# EAGLE design programmer (EAGLE 6.5.0)
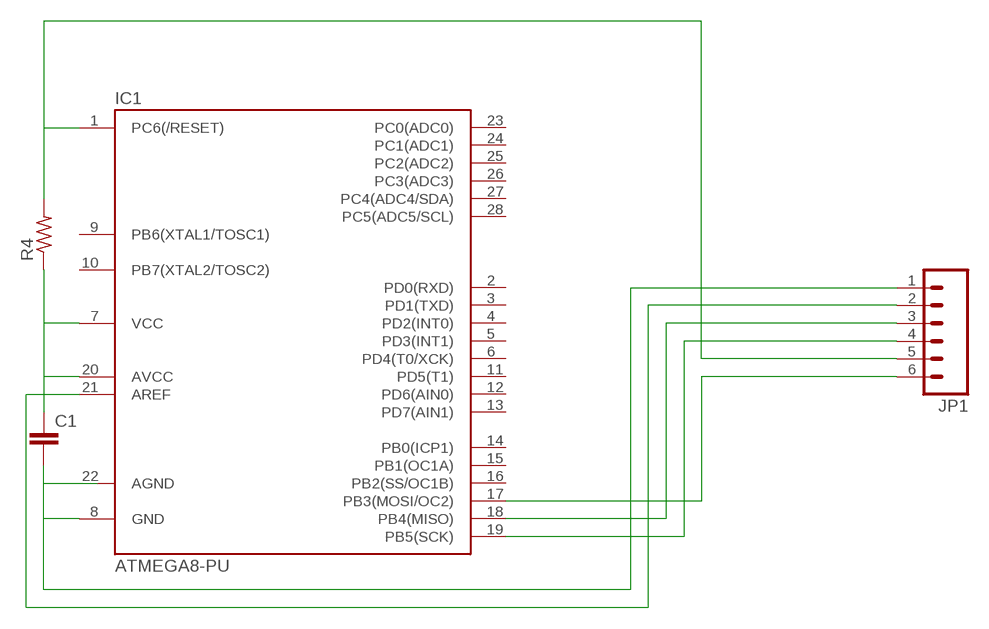
[diagram p0: schematic, sheet 1]

## Parts
C1  C2.5/4  [C2.5-4]
IC1  ATMEGA8-PU  [DIL28-3]
JP1  M06LONGPADS  [1X06_LONGPADS]
R4  R-US_0207/12  [0207/12]

## Nets
N$1: C1.2 IC1.8(GND) JP1.1
N$2: C1.1 IC1.7(VCC) IC1.21(AREF) JP1.2 R4.1
N$3: IC1.18(PB4(MISO)) JP1.3
N$4: IC1.19(PB5(SCK)) JP1.4
N$5: IC1.1(PC6(/RESET)) JP1.5 R4.2
N$6: IC1.17(PB3(MOSI/OC2)) JP1.6
N$8: IC1.20(AVCC)
Unconnected: IC1.2(PD0(RXD)) IC1.3(PD1(TXD)) IC1.4(PD2(INT0)) IC1.5(PD3(INT1)) IC1.6(PD4(T0/XCK)) IC1.9(PB6(XTAL1/TOSC1)) IC1.10(PB7(XTAL2/TOSC2)) IC1.11(PD5(T1)) IC1.12(PD6(AIN0)) IC1.13(PD7(AIN1)) IC1.14(PB0(ICP1)) IC1.15(PB1(OC1A)) IC1.16(PB2(SS/OC1B)) IC1.23(PC0(ADC0)) IC1.24(PC1(ADC1)) IC1.25(PC2(ADC2)) IC1.26(PC3(ADC3)) IC1.27(PC4(ADC4/SDA)) IC1.28(PC5(ADC5/SCL))

## Power pins joined to a net without a drawn wire
AGND: IC1.22(AGND)

## Library data of the parts
C1 = capacitor-wima:C: CAPACITOR naming: grid - package width
IC1 = atmega8:ATMEGA8-PU
JP1 = SparkFun:M06: Header 6 Standard 6-pin 0.1" header. Use with straight break away headers (SKU : PRT-00116), right angle break away headers (PRT-00553), swiss pins (PRT-00743), machine pins (PRT-00117), and female headers (PRT-00115). Molex polarized connector foot print use with SKU : PRT-08094 with associated crimp pins and housings. NOTES ON THE VARIANTS LOCK and LOCK_LONGPADS... This footprint was designed to help hold the alignment of a through-hole component (i.e. 6-pin header) while soldering it into place. You may notice that each hole has been shifted either up or down by 0.005 of an inch from it's more standard position (which is a perfectly straight line). This slight alteration caused the pins (the squares in the middle) to touch the edges of the holes. Because they are alternating, it causes a "brace" to hold the component in place. 0.005 has proven to be the perfect amount of "off-center" position when using our standard breakaway headers. Although looks a little odd when you look at the bare footprint, once you have a header in there, the alteration is very hard to notice. Also, if you push a header all the way into place, it is covered up entirely on the bottom side. This idea of altering the position of holes to aid alignment will be further integrated into the Sparkfun Library for other footprints. It can help hold any component with 3 or more connection pins.
R4 = resistor:R-US_: RESISTOR, American symbol

## Board
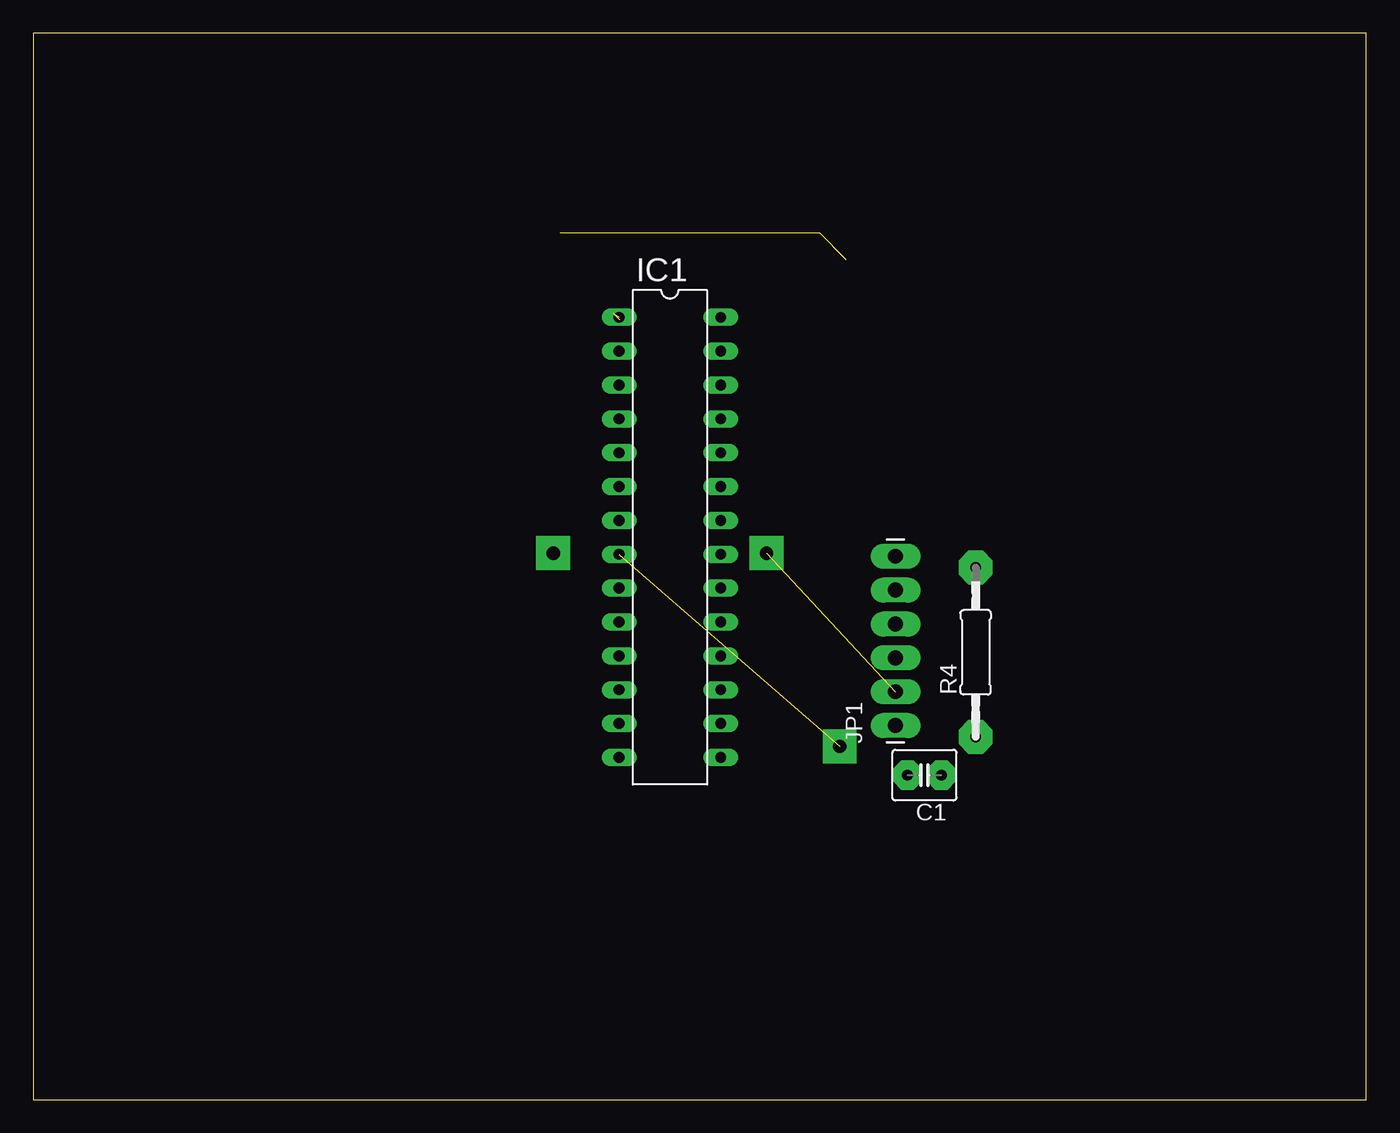
[diagram p1: board, top side]
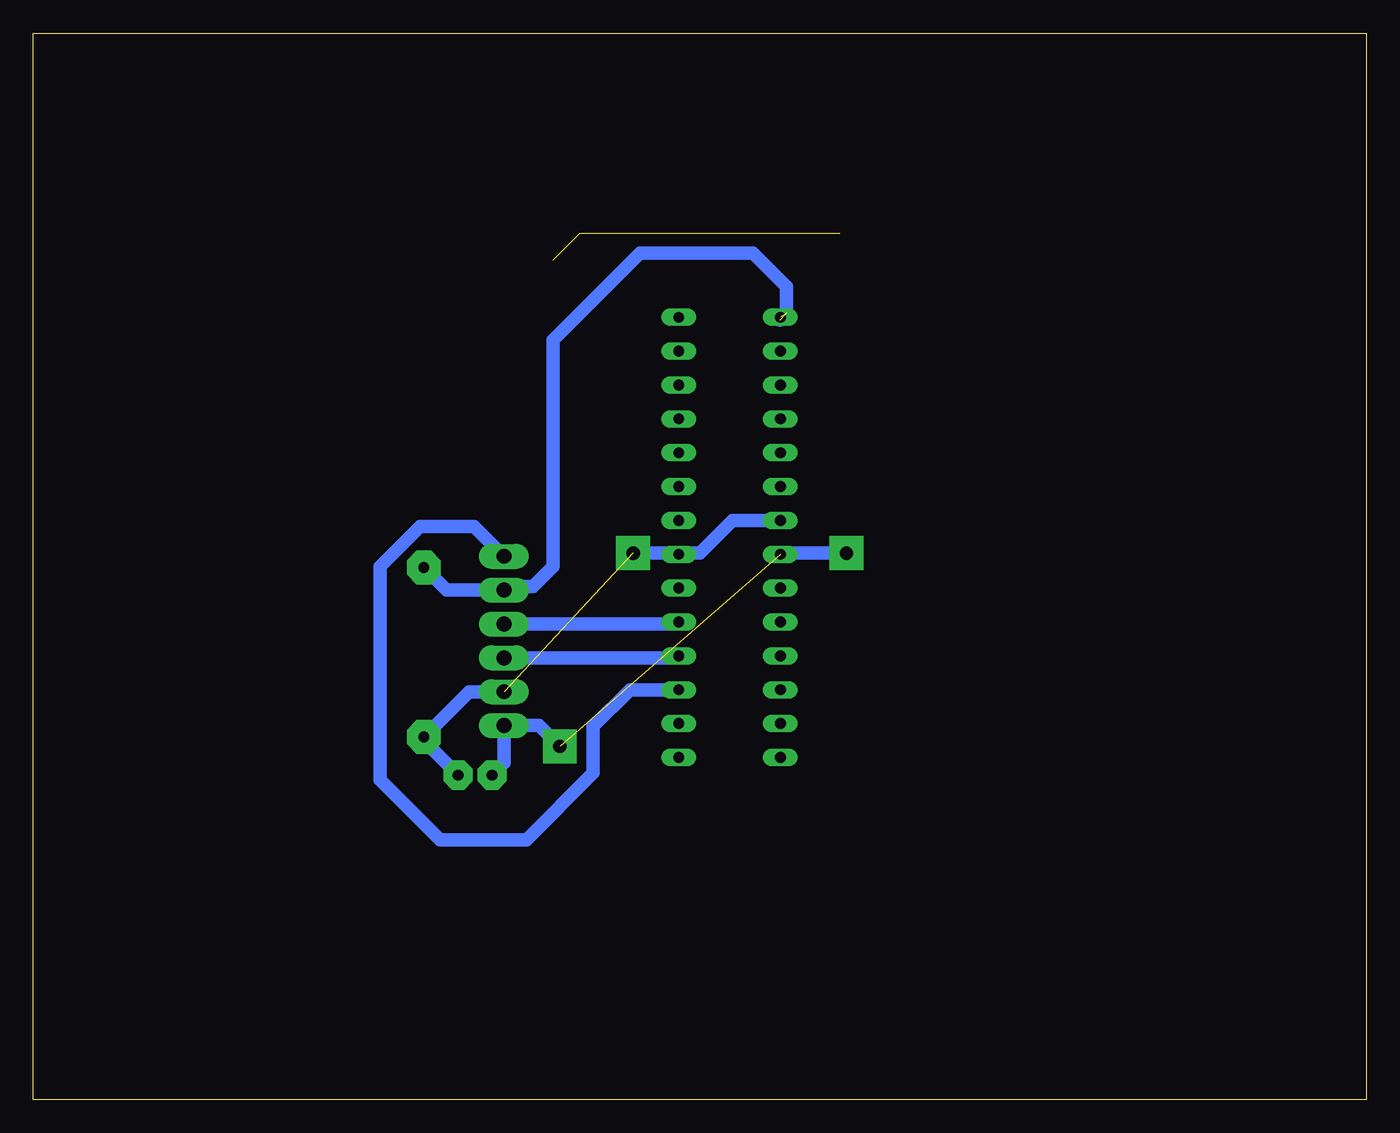
[diagram p2: board, bottom side, seen from below]

Size 100 x 80 mm. Coordinates in mm from the lower left corner, seen from the top.
Outline: 0,0 100,0 100,80 0,80 0,0
Copper layers (1*16): Top 0.035mm / dielectric 1.5mm / Bottom 0.035mm
Design rules "default": minimum track width 10mil, minimum drill 24mil, track to track 8mil, track to pad 8mil, pad to pad 8mil, via to via 8mil, smd to smd 8mil, copper to edge 40mil, drill to drill 8mil, minimum pad ring 10mil, minimum via ring 8mil, stop-mask expansion 4mil, vias tented up to drill 0mil, thermal gap 10mil

### Footprints (pad centres in the part's own frame; a part is rotated, then mirrored left to right if it is on the bottom)
C2.5-4 = drill 0.813 pad 2.184 octagon: 1 -1.27,0; 2 1.27,0
DIL28-3 = drill 0.813 long: 1 -16.51,-3.81; 2 -13.97,-3.81; 3 -11.43,-3.81; 4 -8.89,-3.81; 5 -6.35,-3.81; 6 -3.81,-3.81; 7 -1.27,-3.81; 8 1.27,-3.81; 9 3.81,-3.81; 10 6.35,-3.81; 11 8.89,-3.81; 12 11.43,-3.81; 13 13.97,-3.81; 14 16.51,-3.81; 15 16.51,3.81; 16 13.97,3.81; 17 11.43,3.81; 18 8.89,3.81; 19 6.35,3.81; 20 3.81,3.81; 21 1.27,3.81; 22 -1.27,3.81; 23 -3.81,3.81; 24 -6.35,3.81; 25 -8.89,3.81; 26 -11.43,3.81; 27 -13.97,3.81; 28 -16.51,3.81
1X06_LONGPADS = drill 1.118 pad 1.88 long: 1 0,0; 2 2.54,0; 3 5.08,0; 4 7.62,0; 5 10.16,0; 6 12.7,0
0207/12 = drill 0.813 pad 2.54 octagon: 1 -6.35,0; 2 6.35,0

### Placement (x,y rotation side)
C1  66.86,24.34 180 top
IC1  47.76,42.18 270 top
JP1  64.69,28.06 90 top
R4  70.7,33.56 90 top

### Tracks (layer width: path | path; a pad name or v marks a point on that pad's centre or on a via)
N$1  (via drill 1 pad 2.54)  (1 unrouted)
  Bottom 1.016: C1.2 64.69,25.24 JP1.1 | JP1.1 64.75,28 65,28 | IC1.8 43.86,41 39,41 | v60.5,26.5 62.06,28.06 JP1.1
N$2  (1 unrouted)
  Bottom 1.016: JP1.2 67.31,30.6 R4.1 70.7,26.91 C1.1 | IC1.7 47.55,43.45 50,41 51.48,41 IC1.21 51.66,41 55,41
N$3
  Bottom 1.016: JP1.3 51.72,33.14 IC1.18
N$4
  Bottom 1.016: JP1.4 51.72,35.68 IC1.19
N$5  (4 unrouted)
  Bottom 1.016: R4.2 69.01,38.22 JP1.5 64.41,38.5 62.5,38.5 61,40 61,57 54.5,63.5 46,63.5 43.5,61 43.5,59 | IC1.1 44,58.64 44,58.5
N$6
  Bottom 1.016: JP1.6 66.93,43 71,43 74,40 74,24 69.5,19.5 63,19.5 58,24.5 58,28 55.25,30.75 IC1.17
N$7  (via drill 1 pad 2.54)
  other vias: 55,41
N$9  (via drill 1 pad 2.54)
  other vias: 39,41